# EAGLE design m2_old (EAGLE 7.7.0)
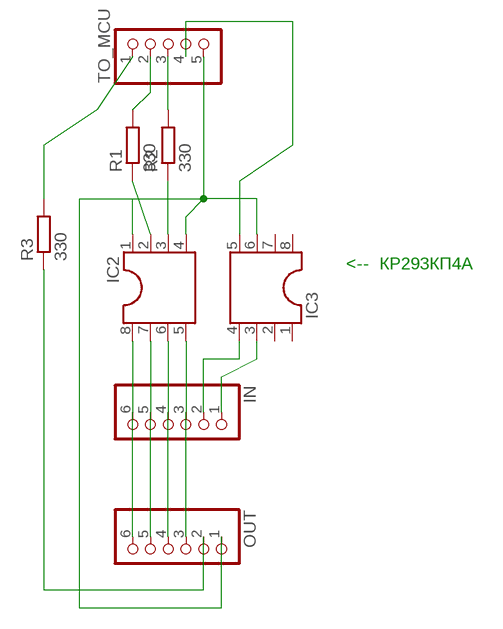
[diagram p0: schematic, sheet 1]

## Parts
IC2  DIL8  [DIL08]
IC3  DIL8  [DIL08]
IN  PINHD-1X6  [1X06]
OUT  PINHD-1X6  [1X06]
R1  330  R-EU_0204/5  [0204/5]
R2  330  R-EU_0204/5  [0204/5]
R3  330  R-EU_0204/5  [0204/5]
TO_MCU  PINHD-1X5  [1X05]

## Nets
N$1: IC2.8 IN.6 OUT.6
N$2: IC2.2 R1.1
N$3: IC2.3 R2.1
N$4: IC2.7 IN.5 OUT.5
N$5: IC2.1 IC2.4 IC3.6 OUT.1 TO_MCU.5
N$6: IC2.6 IN.4 OUT.4
N$7: IC2.5 IN.3 OUT.3
N$8: IC3.4 IN.2
N$9: IC3.3 IN.1
N$10: OUT.2 R3.1
N$11: R1.2 TO_MCU.2
N$12: R2.2 TO_MCU.3
N$13: IC3.5 TO_MCU.4
N$14: R3.2 TO_MCU.1
Unconnected: IC3.1 IC3.2 IC3.7 IC3.8

## Notes on the sheet
- <--  КР293КП4А

## Library data of the parts
IC2 IC3 = ic-package:DIL8: Dual In Line / Socket
IN OUT = pinhead:PINHD-1X6: PIN HEADER
R1-R3 = resistor:R-EU_: RESISTOR, European symbol
TO_MCU = pinhead:PINHD-1X5: PIN HEADER

## Board
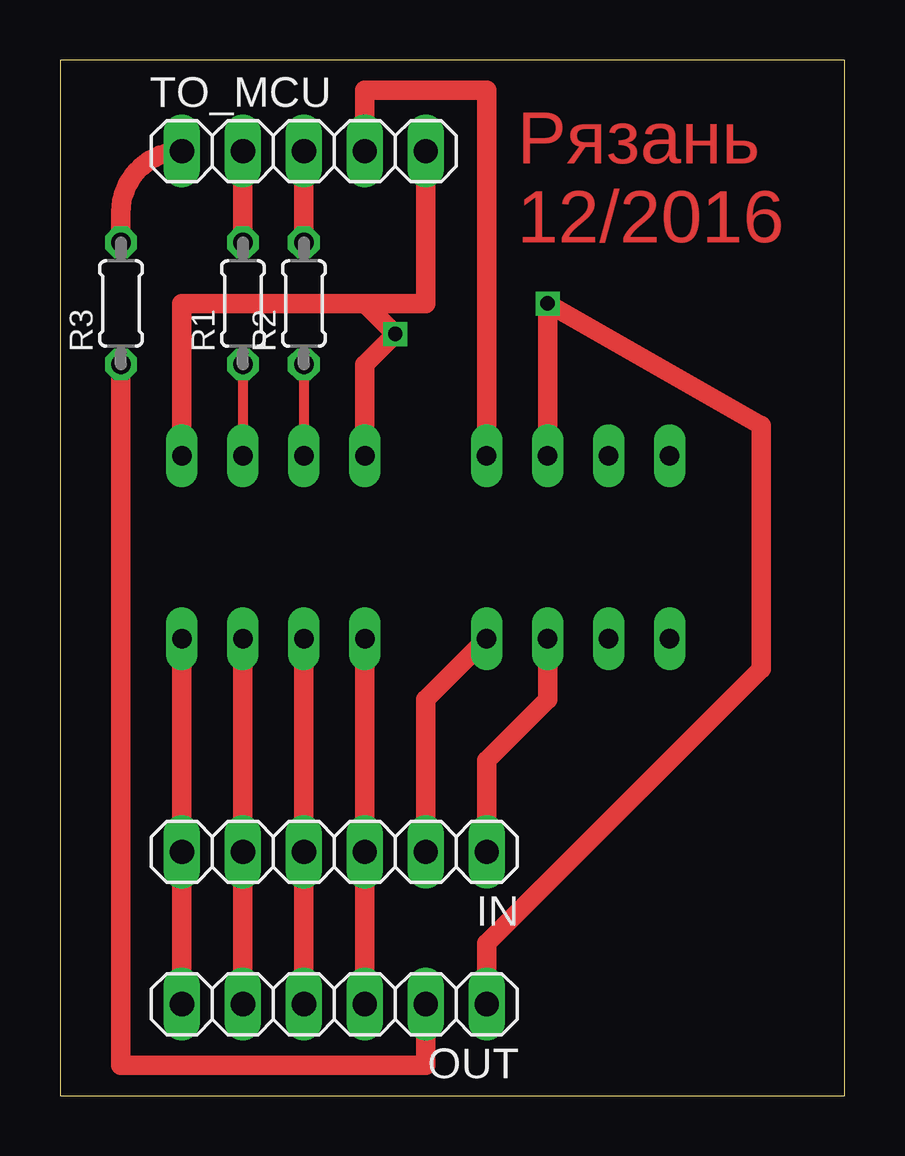
[diagram p1: board, top side]
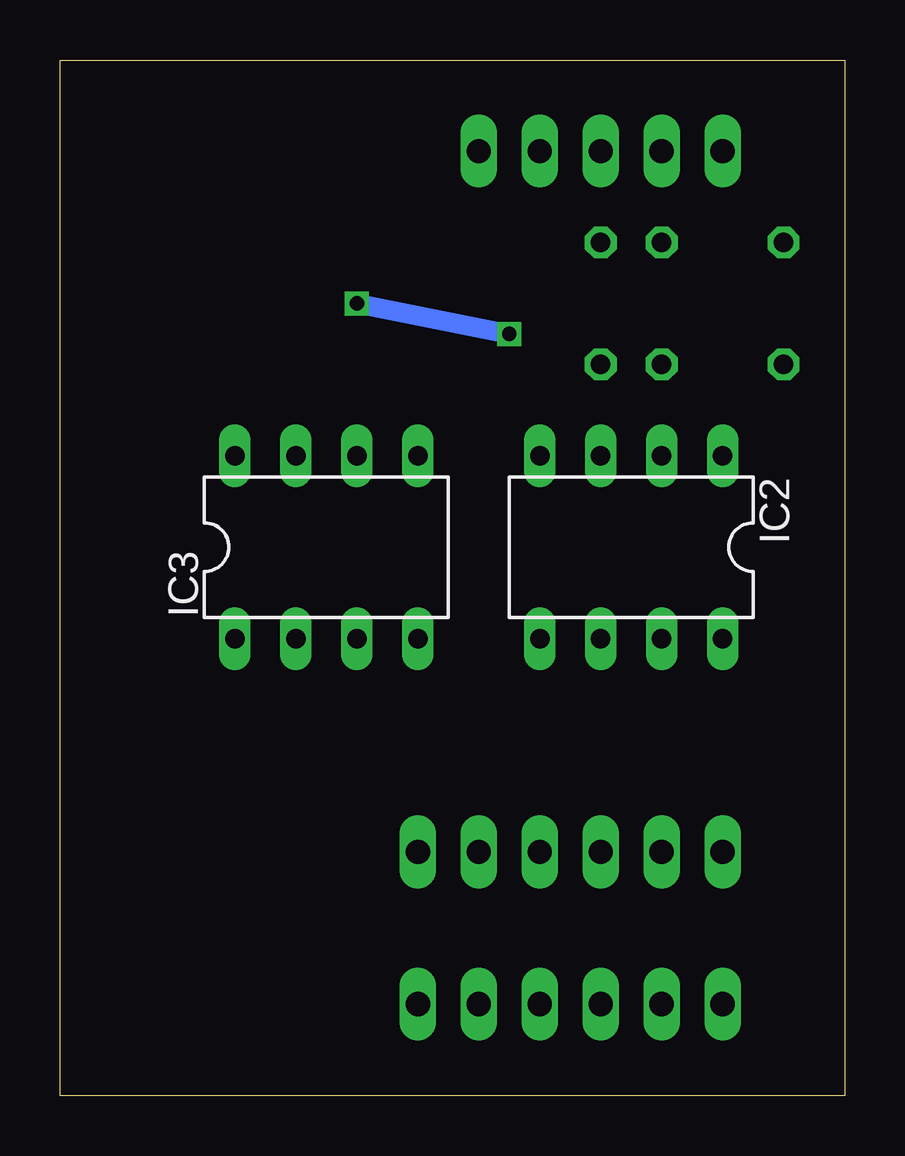
[diagram p2: board, bottom side, seen from below]

Size 32.69 x 43.17 mm. Coordinates in mm from the lower left corner, seen from the top.
Outline: 0,0 32.69,0 32.69,43.17 0,43.17 0,0
Copper layers (1*16): Top 0.035mm / dielectric 1.5mm / Bottom 0.035mm
Design rules "default": minimum track width 10mil, minimum drill 24mil, track to track 8mil, track to pad 8mil, pad to pad 8mil, via to via 8mil, smd to smd 8mil, copper to edge 40mil, drill to drill 8mil, minimum pad ring 10mil, minimum via ring 8mil, stop-mask expansion 4mil, vias tented up to drill 0mil, thermal gap 10mil

### Footprints (pad centres in the part's own frame; a part is rotated, then mirrored left to right if it is on the bottom)
DIL08 = drill 0.813 long: 1 -3.81,-3.81; 2 -1.27,-3.81; 3 1.27,-3.81; 4 3.81,-3.81; 5 3.81,3.81; 6 1.27,3.81; 7 -1.27,3.81; 8 -3.81,3.81
1X06 = drill 1.016 long: 1 -6.35,0; 2 -3.81,0; 3 -1.27,0; 4 1.27,0; 5 3.81,0; 6 6.35,0
0204/5 = drill 0.813 octagon: 1 -2.54,0; 2 2.54,0
1X05 = drill 1.016 long: 1 -5.08,0; 2 -2.54,0; 3 0,0; 4 2.54,0; 5 5.08,0

### Placement (x,y rotation side)
IC2  8.89,22.86 180 bottom
IC3  21.59,22.86 0 bottom
IN  11.43,10.16 180 top
OUT  11.43,3.81 180 top
R1  7.62,33.02 90 top
R2  10.16,33.02 90 top
R3  2.54,33.02 90 top
TO_MCU  10.16,39.37 0 top

### Tracks (layer width: path | path; a pad name or v marks a point on that pad's centre or on a via)
N$1
  Top 0.813: OUT.6 IN.6 IC2.8
N$2
  Top 0.406: R1.1 IC2.2
N$3
  Top 0.406: R2.1 IC2.3
N$4
  Top 0.813: OUT.5 IN.5 IC2.7
N$5  (via drill 0.6)
  Top 0.813: IC2.1 5.08,33.02 12.7,33.02 | OUT.1 17.78,6.35 29.21,17.78 29.21,27.94 v20.32,33.02 IC3.6 | 12.7,33.02 v13.97,31.75 12.7,30.48 IC2.4 | TO_MCU.5 15.24,33.02 12.7,33.02
  Bottom 0.813: v20.32,33.02 v13.97,31.75
N$6
  Top 0.813: OUT.4 IN.4 IC2.6
N$7
  Top 0.813: OUT.3 IN.3 IC2.5
N$8
  Top 0.813: IN.2 15.24,16.51 IC3.4
N$9
  Top 0.813: IN.1 17.78,13.97 20.32,16.51 IC3.3
N$10
  Top 0.813: OUT.2 15.24,1.27 2.54,1.27 R3.1
N$11
  Top 0.813: R1.2 TO_MCU.2
N$12
  Top 0.813: R2.2 TO_MCU.3
N$13
  Top 0.813: TO_MCU.4 12.7,41.91 17.78,41.91 17.78,34.29 IC3.5
N$14
  Top 0.813: TO_MCU.1 arc90 2.54,36.83 R3.2

### Text on the board
Top: Рязань / 12/2016 | ☭